# Altium schematic sheet HS_Inverted-Normal_Switch_LOW_PWR.SchDoc: Data Logger - Inverted HS, Normal Switches
size A4; DocumentNumber: DL-MB-6; SheetNumber: 6; SheetTotal: 11
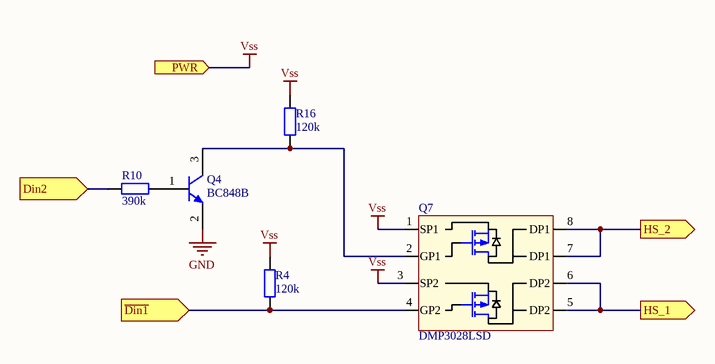
[diagram p0: HS_Inverted-Normal_Switch_LOW_PWR.SchDoc]

## Parts
Q4  BC848B  [SOT23_N]
Q7  DMP3028LSD  [SOIC-8_SOIC127P600X175-8N]
R4  120k  [RES-1206_M]
R10  390k  [RES-1206_M]
R16  120k  [RES-1206_M]

## Ports
Din2 (in), HS_1 (out), HS_2 (out), PWR (in), ~{Din1} (in)

## Nets
GND: Q4.2(E)
Vss: Q7.1(SP1) Q7.3(SP2) R4.2 R16.2 ; port PWR
~{Din1}: Q7.4(GP2) R4.1 ; port ~{Din1}
Din2: R10.1 ; port Din2
HS_1: Q7.5(DP2) Q7.6(DP2) ; port HS_1
HS_2: Q7.7(DP1) Q7.8(DP1) ; port HS_2
NetQ4_1: Q4.1(B) R10.2
NetQ4_3: Q4.3(C) Q7.2(GP1) R16.1

## Notes on the sheet
- Title
- Size
- Date:
- A4
- Number
- Time:
- Sheet
- of
- Revision
- File:
- Drawn By:

## Library data of the parts
Q4 = BC848B: NPN Silicon AF Transistor, 30 V VCEO, 100 mA IC, SOT23, Reel, Green; Manufacturer: Infineon; fT (typ): 250 MHz; Green: TRUE; IBM (max): 200 mA; IC (max): 100 mA; ICBO (max): 15 nA; Ptot (max): 330 mW; VCBO (max): 30 V; VEBO (max): 6 V; PackageVersion: Apr-08; PackageReference: SOT23; PackageDescription: 3-Pin Small Outline Transistor Package, 1.3 x 2.9 mm Body, 0.95 mm Pitch; ICM (max): 200 mA; Packing: Reel; Polarity: NPN; VCEO (max): 30 V; Mounting Technology: Surface Mount; PartNumber: BC848B; ComponentLink1Description: Manufacturer URL; ComponentLink1URL: http://www.infineon.com/; ComponentLink2Description: Datasheet; ComponentLink2URL: http://www.infineon.com/dgdl/bc847series_bc848series_bc849series_bc850series.pdf?folderId=db3a304314dca389011541d30fa21656&fileId=db3a304314dca389011541d4630a1657; ComponentLink3Description: Package Specification; ComponentLink3URL: http://www.infineon.com/dgdl/SOT23-Package_Overview.pdf?folderId=db3a30431936bc4b0119532290053c66&fileId=db3a30431936bc4b0119533468123c85
Q7 = DMP3028LSD: MOSFET 2P-CH 30V 6A SO-8, VgMax=20V, Max Drain Resistance (38 mΩ); Manufacturer: Diodes; Manufacturer Part Number: DMP3028LSD-13; Rds On Max: 25mR; Input Capacitance: 1.241nF; Max Power Dissipation: 1.3W; RoHS: Yes; Category: MOSFETs; Mount: Surface Mount; Case/Package: SOIC; Min Operating Temperature: -55°C; Max Operating Temperature: 150°C; Packaging: Tape and Reel; Drain to Source Voltage (Vdss): 30V; Continuous Drain Current (ID): 6A; RoHS Compliant: Yes; ComponentLink1URL: http://www.mouser.com/ds/2/115/DMP3028LSD-776487.pdf?src-supplier=Mouser; ComponentLink1Description: http://www.mouser.com/ds/2/115/DMP3028LSD-776487.pdf?src-supplier=Mouser; ComponentLink2URL: https://www.diodes.com/assets/Datasheets/DMP3028LSD.pdf?src-supplier=Digi-Key; ComponentLink2Description: https://www.diodes.com/assets/Datasheets/DMP3028LSD.pdf?src-supplier=Digi-Key
R4 R10 R16 = Res2: Resistor; Published: 8-Jun-2000; LatestRevisionDate: 17-Jul-2002; LatestRevisionNote: Re-released for DXP Platform.; PackageReference: 1206; Publisher: Altium Limited; PackageDescription: Chip Resistor 1206 Case Size
  R4 R16: Value: 120k
  R10: Value: 390k